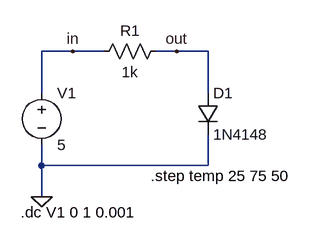
[diagram p0: schematic Temperature Effects on Diode Behavior .asc]
Temperature Effects on Diode Behavior .asc, the LTspice schematic file:
Version 4.1
SHEET 1 880 680
WIRE -16 16 -64 16
WIRE 32 16 -16 16
WIRE 144 16 112 16
WIRE 192 16 144 16
WIRE -64 80 -64 16
WIRE 192 80 192 16
WIRE -64 192 -64 160
WIRE 192 192 192 144
WIRE 192 192 -64 192
WIRE -64 240 -64 192
FLAG -64 240 0
FLAG -16 16 in
FLAG 144 16 out
SYMBOL diode 176 80 R0
SYMATTR InstName D1
SYMATTR Value 1N4148
SYMBOL voltage -64 64 R0
WINDOW 123 0 0 Left 0
WINDOW 39 0 0 Left 0
SYMATTR InstName V1
SYMATTR Value 5
SYMBOL res 128 0 R90
WINDOW 0 0 56 VBottom 2
WINDOW 3 32 56 VTop 2
SYMATTR InstName R1
SYMATTR Value 1k
TEXT 104 208 Left 2 !.step temp 25 75 50
TEXT -96 264 Left 2 !.dc V1 0 1 0.001

The netlist it stands for:
* Temperature Effects on Diode Behavior .asc
D1 out 0 1N4148
V1 in 0 5
R1 out in 1k
.model D D
.lib standard.dio
.step temp 25 75 50
.dc V1 0 1 0.001
.backanno
.end